# Altium project ECEN 403 EEG Device.PrjPcb
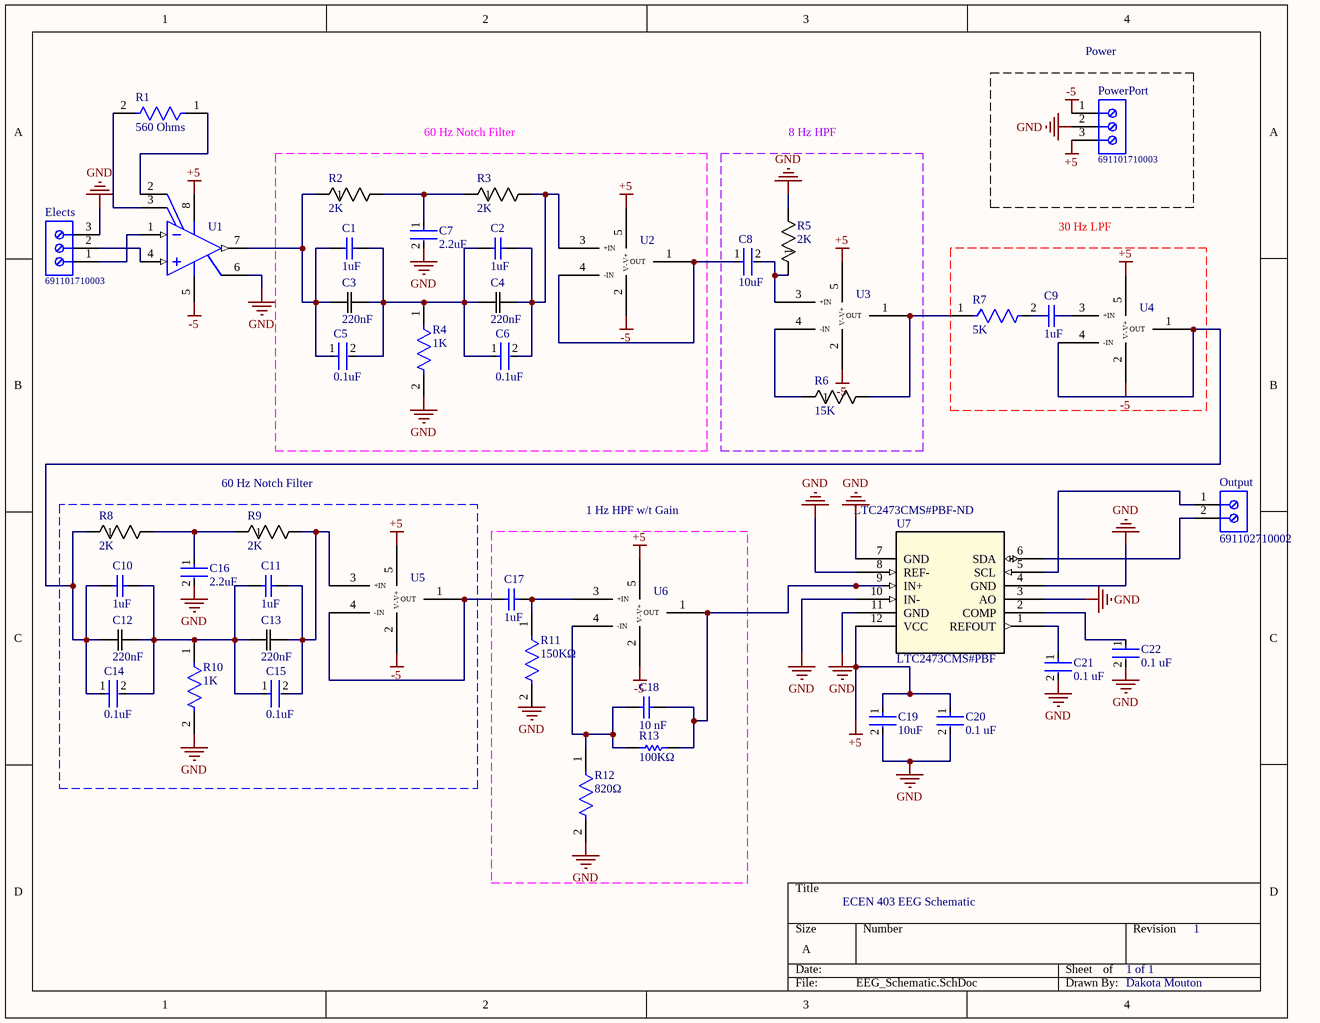
[diagram p0: EEG_Schematic.SchDoc]
1 sheet, 45 parts. Net scope: global (net labels, ports and power ports of the same name join across sheets).
Board file: EEG_PCB.PcbDoc

## Sheet EEG_Schematic.SchDoc
size A; SheetNumber: 1; SheetTotal: 1

### Parts
C1  1uF  [CAPC1608X90X35LL15T15]
C2  1uF  [CAPC1608X90X35LL15T15]
C3  220nF  [CAP_CL05_SAM]
C4  220nF  [CAP_CL05_SAM]
C5  0.1uF  [FP-CL278-IPC_C]
C6  0.1uF  [FP-CL278-IPC_C]
C7  2.2uF  [FP-CL10-IPC_A]
C8  10uF  [FP-CL21-IPC_C]
C9  1uF  [CAPC1608X90X35LL15T15]
C10  1uF  [CAPC1608X90X35LL15T15]
C11  1uF  [CAPC1608X90X35LL15T15]
C12  220nF  [CAP_CL05_SAM]
C13  220nF  [CAP_CL05_SAM]
C14  0.1uF  [FP-CL278-IPC_C]
C15  0.1uF  [FP-CL278-IPC_C]
C16  2.2uF  [FP-CL10-IPC_A]
C17  1uF  [CAPC1608X90X35LL15T15]
C18  10 nF  [CAPC1005X56X25NL10T15]
C19  10uF  [FP-CL21-IPC_C]
C20  0.1 uF  [FP-CL278-IPC_C]
C21  0.1 uF  [FP-CL278-IPC_C]
C22  0.1 uF  [FP-CL278-IPC_C]
Elects  691101710003  [691101710003]
Output  691102710002  [691102710002]
PowerPort  691101710003  [691101710003]
R1  560 Ohms  [FP-CRGCQ1206-IPC_C]
R2  2K  [STA_RNCP0805_STP]
R3  2K  [STA_RNCP0805_STP]
R4  1K  [FP-RNCP0805-MFG]
R5  2K  [STA_RNCP0805_STP]
R6  15K  [STA_RNCP0805_STP]
R7  5K  [FP-RT1206-0_65-MFG]
R8  2K  [STA_RNCP0805_STP]
R9  2K  [STA_RNCP0805_STP]
R10  1K  [FP-RNCP0805-MFG]
R11  150KΩ  [FP-CRGP0603-IPC_C]
R12  820Ω  [FP-RMCF1206-IPC_C]
R13  100KΩ  [RESC2013X60X30NL20T20]
U1  AD8221BRZ-R7 Instrumentation Amplifier  [ADI-R-8_M]  (value not drawn)
U2  ADA4610-1ARJZ-R7  [RJ_5_ADI]  (value not drawn)
U3  ADA4610-1ARJZ-R7  [RJ_5_ADI]  (value not drawn)
U4  ADA4610-1ARJZ-R7  [RJ_5_ADI]  (value not drawn)
U5  ADA4610-1ARJZ-R7  [RJ_5_ADI]  (value not drawn)
U6  ADA4610-1ARJZ-R7  [RJ_5_ADI]  (value not drawn)
U7  LTC2473CMS#PBF  Supplier Part Number 1: LTC2473CMS#PBF-ND  [MSOP-12_MS_LIT]

### Blocks framed on the sheet
Power: PowerPort
60 Hz Notch Filter: C1-C7 R2-R4 U2
8 Hz HPF: C8 R5 R6 U3
30 Hz LPF: C9 R7 U4
60 Hz Notch Filter: C10-C16 R8-R10 U5
1 Hz HPF w/t Gain: C17 C18 R11-R13 U6

### Nets
+5: C19.1 C20.1 PowerPort.3 U1.8(VS+) U2.5(V+) U3.5(V+) U4.5(V+) U5.5(V+) U6.5(V+) U7.12(VCC)
-5: PowerPort.1 U1.5(VS-) U2.2(V-) U3.2(V-) U4.2(V-) U5.2(V-) U6.2(V-)
GND: C7.2 C16.2 C19.2 C20.2 C21.2 C22.2 Elects.3 PowerPort.2 R4.2 R5.2 R10.2 R12.2 U1.6(REF) U7.3(AO) U7.4(GND) U7.7(GND) U7.8(REF-) U7.10(IN-) U7.11(GND)
NetC1_1: C1.1 C3.1 C5.1 R2.1 U1.7(VOUT)
NetC1_2: C1.2 C2.1 C3.2 C4.1 C5.2 C6.1 R4.1
NetC2_2: C2.2 C4.2 C6.2 R3.2 U2.3(+IN)
NetC7_1: C7.1 R2.2 R3.1
NetC8_1: C8.1 U2.1(OUT) U2.4(-IN)
NetC8_2: C8.2 R5.1 U3.3(+IN)
NetC9_1: C9.1 R7.2
NetC9_2: C9.2 U4.3(+IN)
NetC10_1: C10.1 C12.1 C14.1 R8.1 U4.1(OUT) U4.4(-IN)
NetC10_2: C10.2 C11.1 C12.2 C13.1 C14.2 C15.1 R10.1
NetC11_2: C11.2 C13.2 C15.2 R9.2 U5.3(+IN)
NetC16_1: C16.1 R8.2 R9.1
NetC17_1: C17.1 U5.1(OUT) U5.4(-IN)
NetC17_2: C17.2 R11.1 U6.3(+IN)
NetC18_1: C18.1 R12.1 R13.1 U6.4(-IN)
NetC18_2: C18.2 R13.2 U6.1(OUT) U7.9(IN+)
NetC21_1: C21.1 U7.1(REFOUT)
NetC22_1: C22.1 U7.2(COMP)
NetElects_1: Elects.1 U1.1(IN-)
NetElects_2: Elects.2 U1.4(IN+)
NetOutput_1: Output.1 U7.5(SCL)
NetOutput_2: Output.2 U7.6(SDA)
NetR1_1: R1.1 U1.2(RG)
NetR1_2: R1.2 U1.3(RG)
NetR6_1: R6.1 U3.4(-IN)
NetR6_2: R6.2 R7.1 U3.1(OUT)

Not connected (* = marked no-connect by the designer): R11 2

### Notes on the sheet
- ECEN 403 EEG Schematic
- 1 of 1
- 1
- Dakota Mouton
- Labels drawn without touching a wire or pin: GND

### Library data of the parts
C1 C2 C9-C11 C17 = CMP-2006-02241-1: Part Number: C0603C105K9PACTU; Manufacturer: Kemet; Capacitance: 1uF
C3 C4 C12 C13 = CL05B224KO5NNNC: No Description Available; Mfr_Name: Samsung; Type: DEV; Copyright: Copyright (C) 2021 Ultra Librarian. All rights reserved.; Manufacturer_Part_Number: CL05B224KO5NNNC; Digi-Key_Part_Number_1: 1276-1176-2-ND; Digi-Key_Part_Number_2: 1276-1176-1-ND; Digi-Key_Part_Number_3: 1276-1176-6-ND; RefDes: RefDes; Supplier 1: Digi-Key; Supplier Part Number 1: 1276-1176-1-ND
C5 C6 C14 C15 C20-C22 = CMP-13271-000728-1: Cap Ceramic 100nF 25V X5R ±10% SMD 0402 +85°C Paper T/R; Package Quantity: 1; Height: 0.5mm; Case Code (Metric): 1005; Thickness: 0.022inch; Mount: Surface Mount; Lead Free: Lead Free; Case Code (Imperial): 0402; Packaging: Tape and Reel; Depth: 0.5mm; Voltage: 25V; Min Operating Temperature: -55°C; Voltage Rating: 25V; Dielectric: X5R; Case/Package: 0402; Tolerance: 10%; Width: 0.02inch; Max Operating Temperature: 85°C; Capacitance: 100nF; Length: 1mm; Radiation Hardening: No; Voltage Rating (DC): 25V
C7 C16 = CMP-13271-003582-1: Cap Ceramic 2.2uF 10V X7R ±10% Pad SMD 0603 +125°C T/R; Max Operating Temperature: 125°C; Package Quantity: 1; Thickness: 0.035inch; Capacitance: 2.2uF; Height: 0.8mm; Case/Package: 0603; Case Code (Metric): 1608; Radiation Hardening: No; Dielectric: X7R; Mount: Surface Mount; Contact Plating: Tin; Material: Ceramic; Length: 1.6mm; Packaging: Tape and Reel; Width: 0.031inch; Min Operating Temperature: -55°C; Case Code (Imperial): 0603; Depth: 0.8mm; Voltage Rating: 10V; Tolerance: 10%
C8 C19 = CMP-13271-001698-1: CL21 Series 0805 10uF 10V ±10% Tolerance X5R Multilayer Ceramic Chip Capacitor; Capacitance: 10uF; Width: 0.049inch; Case Code (Imperial): 0805; Length: 0.079inch; Dielectric: X5R; Voltage Rating: 10V; Case/Package: 0805; Max Operating Temperature: 85°C; Packaging: Tape and Reel; Thickness: 0.053inch; Min Operating Temperature: -55°C; Mount: Surface Mount; Termination: Wraparound; Contact Plating: Tin; Tolerance: 10%; Case Code (Metric): 2012
C18 = CMP-2008-02797-1: Part Number: 0402YC103KAT2A; Manufacturer: AVX Interconnect / Elco; Capacitance: 10nF
Elects PowerPort = CMP-1502-03257-1: Series 101 - 5.00 mm Horizontal Entry Modular with Pressure Clamp WR-TBL, 3 pin; Manufacturer: Wurth Elektronik; Pitch: 5.00mm; Pin Number: 3; Publisher: WurthElektronik; Part Number: 691101710003; Operating Temperature: -40to105degC; Package Reference: 691101710003; Packaging: Box; Manufacturer URL: http://www.we-online.de; Datasheet URL: http://katalog.we-online.de/em/datasheet/6911017100xx.pdf; Mounting Technology: THT
Output = CMP-1502-03258-1: Series 102 - 5.00 mm Horizontal Entry Modular with Pressure Clamp WR-TBL, 2 pin; Manufacturer: Wurth Elektronik; Pin Number: 2; Pitch: 5.00mm; Manufacturer URL: http://www.we-online.de; Mounting Technology: THT; Publisher: WurthElektronik; Packaging: Box; Package Reference: 691102710002; Datasheet URL: http://katalog.we-online.de/em/datasheet/6911027100xx.pdf; Operating Temperature: -40to105degC; Part Number: 691102710002
R1 = CMP-03211-010161-1: CRGCQ 1206 560R 1%; Manufacturer Part Number: CRGCQ1206F560R; Manufacturer: TE Connectivity; Temperature Coefficient: ±100ppm/°C; Tolerance: 0.01; Power Rating: 0.25W; Resistance: 560Ω; Voltage Rating: 200V; Value: 560Ω; Automotive Grade: Grade 627; Temperature Range Low: -55°C; ComponentLink2Description: Datasheet; Lead Free: Yes; Octopart: https://octopart.com/crgcq1206f560r-te+connectivity-91018289; Temperature: -55°C to +155°C; RoHS: TRUE; Temperature Range High: +155°C; Ipc Land Pattern Name: RESC310155X55; Height: 0.65mm; Device Class L2: Resistors; Digikey Description: CRGCQ 1206 560R 1%; Device Class L1: Passive Components; ComponentLink2URL: https://www.te.com/commerce/DocumentDelivery/DDEController?Action=showdoc&DocId=Data+Sheet%7F1773204-3%7F1%7Fpdf%7FEnglish%7FENG_DS_1773204-3_1.pdf%7F4-2176347-636; Device Class L3: Chip SMD Resistors; Category: Res; Ambient Temperature Range High: +70°C; Series: CRGCQ; Composition: Thick Film; Automotive: Yes; Package: CRGCQ1206
R2 R3 R8 R9 = RNCP0805FTD2K00: No Description Available; Mfr_Name: Stackpole International; Copyright: Copyright (C) 2021 Ultra Librarian. All rights reserved.; Manufacturer_Part_Number: RNCP0805FTD2K00; Digi-Key_Part_Number_1: RNCP0805FTD2K00CT-ND; Digi-Key_Part_Number_2: RNCP0805FTD2K00DKR-ND; Digi-Key_Part_Number_3: RNCP0805FTD2K00TR-ND; RefDes: RefDes; Type: DEV
R4 R10 = CMP-26527-001902-1: 1kΩ ±1% 0.25W 0805 High Power Anti-Sulfur Thin Film Chip Resistor; Resistance: 1kR; Power Rating: 250mW; Temperature Coefficient: 100ppm/°C; Series: RNCP; RoHS Compliant: Yes; Case Code (Metric): 2012; Length: 0.079inch; Case/Package: 0805; Max Power Dissipation: 250mW; Height: 0.024inch; Size Code: 0805; Max Operating Temperature: 155°C; Tolerance: 1%; Min Operating Temperature: -55°C; Width: 0.049inch; Case Code (Imperial): 0805; Packaging: Tape and Reel; Mount: Surface Mount; Features: Moisture Resistant; Lead Free: Lead Free; Resistor Type: Thin Film; Number of Terminations: 2
R5 = RNCP0805FTD2K00: No Description Available; Mfr_Name: Stackpole International; Value: 2KΩ; Copyright: Copyright (C) 2021 Ultra Librarian. All rights reserved.; Manufacturer_Part_Number: RNCP0805FTD2K00; Digi-Key_Part_Number_1: RNCP0805FTD2K00CT-ND; Digi-Key_Part_Number_2: RNCP0805FTD2K00DKR-ND; Digi-Key_Part_Number_3: RNCP0805FTD2K00TR-ND; RefDes: RefDes; Type: DEV
R6 = RNCP0805FTD15K0: No Description Available; Mfr_Name: Stackpole International; Value: 15KΩ; Copyright: Copyright (C) 2021 Ultra Librarian. All rights reserved.; Manufacturer_Part_Number: RNCP0805FTD15K0; Digi-Key_Part_Number_1: RNCP0805FTD15K0CT-ND; Digi-Key_Part_Number_2: RNCP0805FTD15K0DKR-ND; Digi-Key_Part_Number_3: RNCP0805FTD15K0TR-ND; RefDes: RefDes; Type: DEV
R7 = CMP-03412-001731-1: RES SMD 5K OHM 0.1% 1/4W 1206; Manufacturer: Yageo; Manufacturer Part Number: RT1206BRD075KL; Resistance: 5kΩ; Value: 5kΩ; Power Rating: 0.25W; Voltage Rating: 200V; Temperature Coefficient: 25ppm/°C; Series: RT; Mouser Description: Thin Film Resistors - SMD 1/4W 5K ohm .1% 25ppm; Temperature: -55°C to +155°C; Composition: Thin Film; Footprint Url: https://www.yageo.com/upload/website/yageo_PYu-R_Mount_10_19050818_343.pdf; Device Class L1: Passive Components; Temperature Range High: +155°C; Octopart: https://octopart.com/rt1206brd075kl-yageo-29806230; Ipc Land Pattern Name: RESC310160X55; Device Class L3: Chip SMD Resistors; Temperature Range Low: -55°C; Height: 0.65mm; ComponentLink2URL: https://www.yageo.com/upload/media/product/productsearch/datasheet/rchip/PYu-RT_1-to-0.01_RoHS_L_11.pdf; Automotive: No; Category: Res; ComponentLink2Description: Datasheet; Package: RT1206-0.65; Lead Free: Yes; Digikey Description: RES SMD 5K OHM 0.1% 1/4W 1206; Device Class L2: Resistors; RoHS: TRUE; Tolerance: 0.1%
R11 = CMP-03211-008323-1: CRGP0603 150KΩ 0.25W ±100ppm/°C 1% 50V; Manufacturer Part Number: CRGP0603F150K; Manufacturer: TE; Tolerance: 0.01; Device Class L3: Chip SMD Resistors; Voltage Rating: 50V; Automotive: No; Temperature Range Low: -55°C; Ipc Land Pattern Name: RESC16080X45; Composition: Thick Film; Device Class L2: Resistors; Temperature Range High: +155°C; Power Rating: 0.25W; RoHS: TRUE; ComponentLink2URL: https://www.te.com/commerce/DocumentDelivery/DDEController?Action=srchrtrv&DocNm=9-1773463-9&DocType=DS&DocLang=English; Octopart: https://octopart.com/crgp0603f150k-te+connectivity-91018727; Resistance: 150KΩ; Ambient Temperature Range High: +70°C; Device Class L1: Passive Components; Lead Free: Yes; Series: CRGP; Value: 150KΩ; Category: Res; Temperature Coefficient: ±100ppm/°C; ComponentLink2Description: Datasheet; Package: CRGP0603; Temperature: -55°C to +155°C; Height: 0.55mm
R12 = CMP-26527-001724-1: 820Ω ±5% 0.25W 1206 Thick Film Chip Resistor AEC-Q200 compliant; Resistance: 820R; Temperature Coefficient: 200ppm/°C; Max Power Dissipation: 250mW; Packaging: Tape and Reel; Min Operating Temperature: -55°C; Radiation Hardening: No; Construction: Rectangular; Height: 0.028inch; Case Code (Imperial): 1206; Mount: Surface Mount; Length: 0.126inch; RoHS Compliant: Yes; Case/Package: 1206; Features: Automotive AEC-Q200; Width: 0.063inch; Contact Plating: Tin; Military Standard: Not; Case Code (Metric): 3216; Number of Terminations: 2; Depth: 1.6mm; Max Operating Temperature: 155°C; Series: RMCF; Resistor Type: Thick Film; Tolerance: 5%
R13 = CMP-2001-01994-1: Manufacturer: KOA Speer; Part Number: RK73H2ATTD1003F; Value: 100KΩ
U1 = CMP-0934-00054-1: Precision Instrumentation Amplifier, 2 V/us, -40 to 125 degC, 8-Pin SOIC (R-8), RoHS, Tape and Reel; Manufacturer: Analog Devices; Slew Rate@G: 1=2 V/us Typ.; VIO: 25 uV Max.; Quiescent Current: 0.9 mA Typ.; -3dB Bandwidth@G: 1=825 kHz; Packing: Tape and Reel; ComponentLink2URL: http://www.analog.com/static/imported-files/data_sheets/AD8221.pdf; ComponentLink3URL: http://www.analog.com/static/imported-files/packages/PKG_PDF/SOIC_Narrow%20(R)/R_8.pdf; Mounting Technology: Surface Mount; DatasheetVersion: Rev. C; PackageVersion: Jun-06; Temperature Range: -40 to 125 degC; ComponentLink1URL: http://www.analog.com/en/index.html; PackageDescription: 8-Pin Standard Small Outline Package, Body 4.9 x 3.9 mm, Pitch 1.27 mm; ComponentLink1Description: Manufacturer URL; ComponentLink3Description: Package Specification; RoHS: TRUE; ComponentLink2Description: Datasheet; PartNumber: AD8221BRZ-R7
U2-U6 = ADA4610-1ARJZ-R7: No Description Available; Mfr_Name: Analog Devices Inc; Copyright: Copyright (C) 2021 Ultra Librarian. All rights reserved.; Manufacturer_Part_Number: ADA4610-1ARJZ-R7; Digi-Key_Part_Number_1: ADA4610-1ARJZ-R7-ND; Digi-Key_Part_Number_2: ADA4610-1ARJZ-R7CT-ND; Digi-Key_Part_Number_3: ADA4610-1ARJZ-R7DKR-ND; Digi-Key_Part_Number_4: ADA4610-1ARJZ-R7TR-ND; RefDes: RefDes; Type: DEV
U7 = LTC2473CMS#PBF: No Description Available; Mfr_Name: Analog Devices / Linear Technology; Copyright: Copyright (C) 2021 Ultra Librarian. All rights reserved.; Manufacturer_Part_Number: LTC2473CMS#PBF; Digi-Key_Part_Number_1: LTC2473CMS#PBF-ND; RefDes: RefDes; Type: DEV; Supplier 1: Digi-Key